# EasyEDA Pro project Dual_Motor_Driver_V3.1.eprj, board PCB2
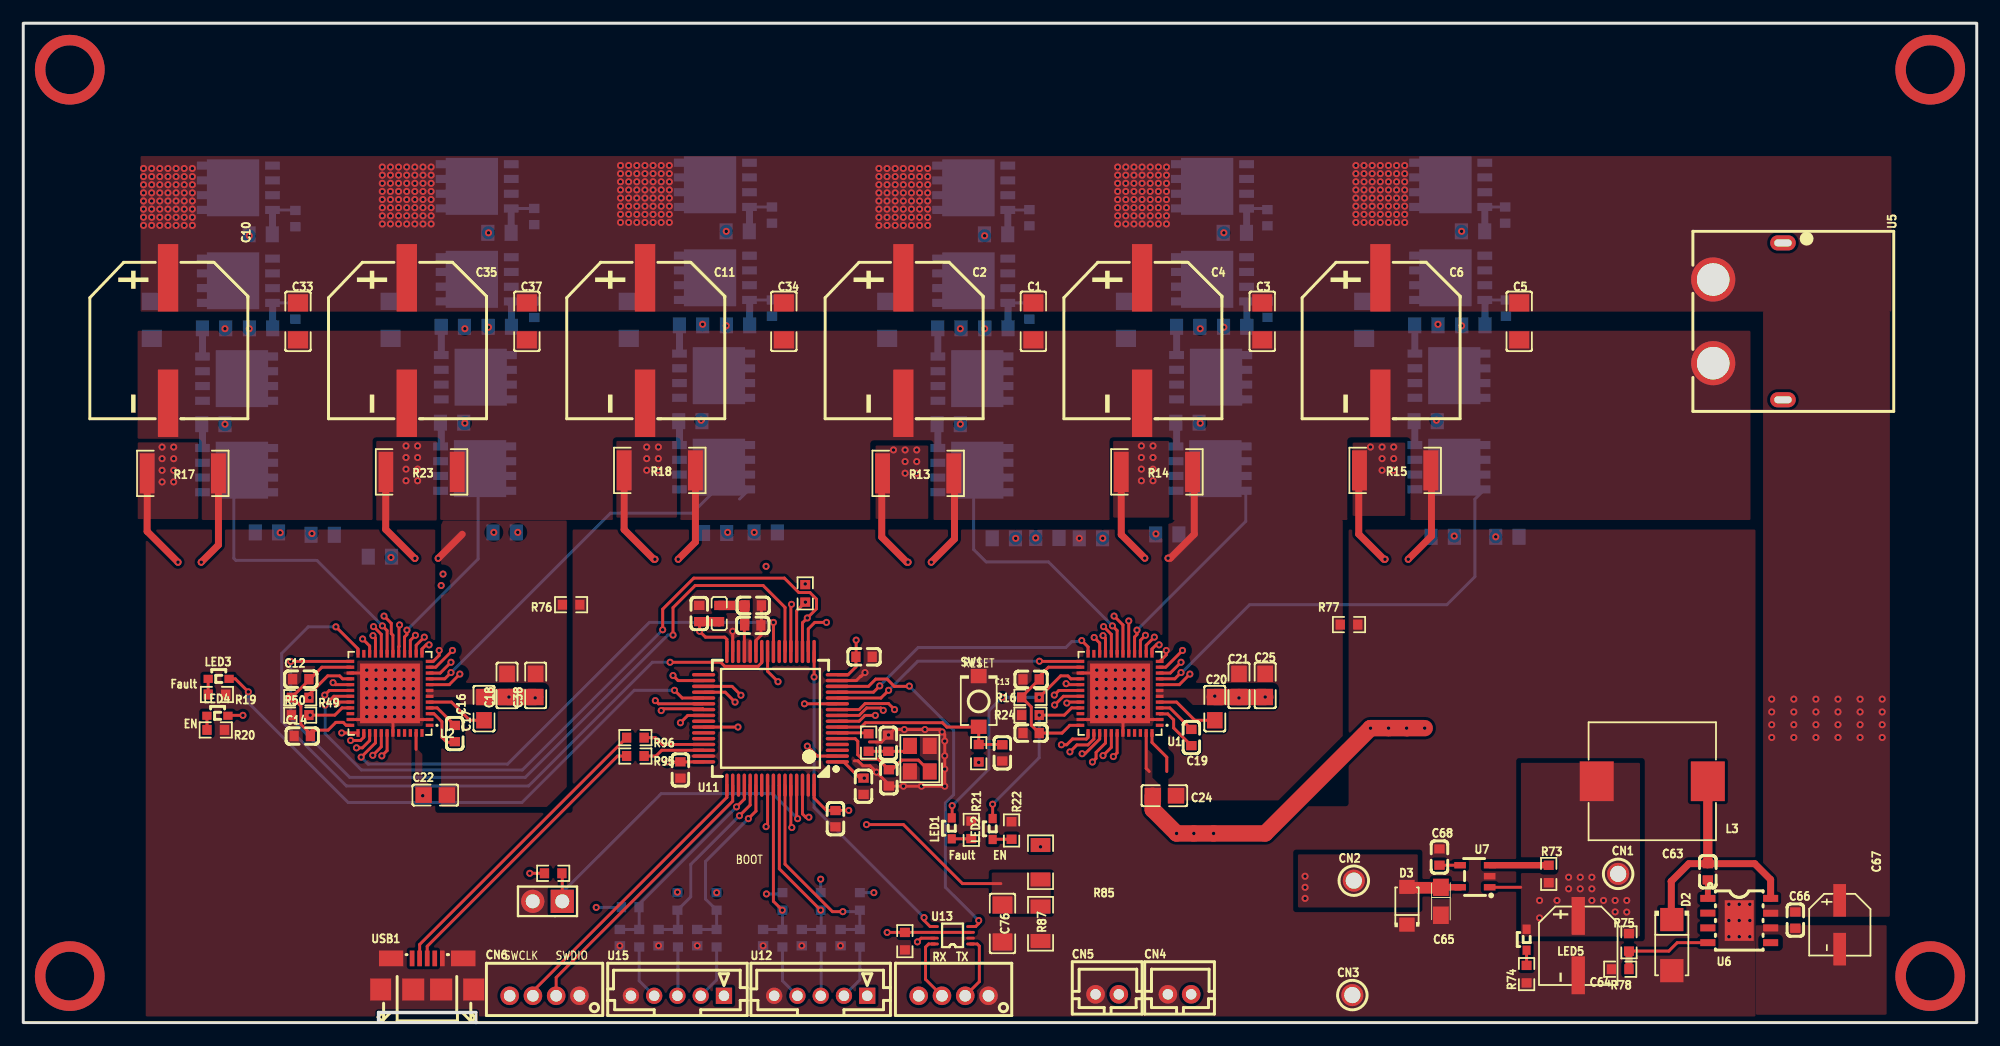
[diagram p2: board, top side]
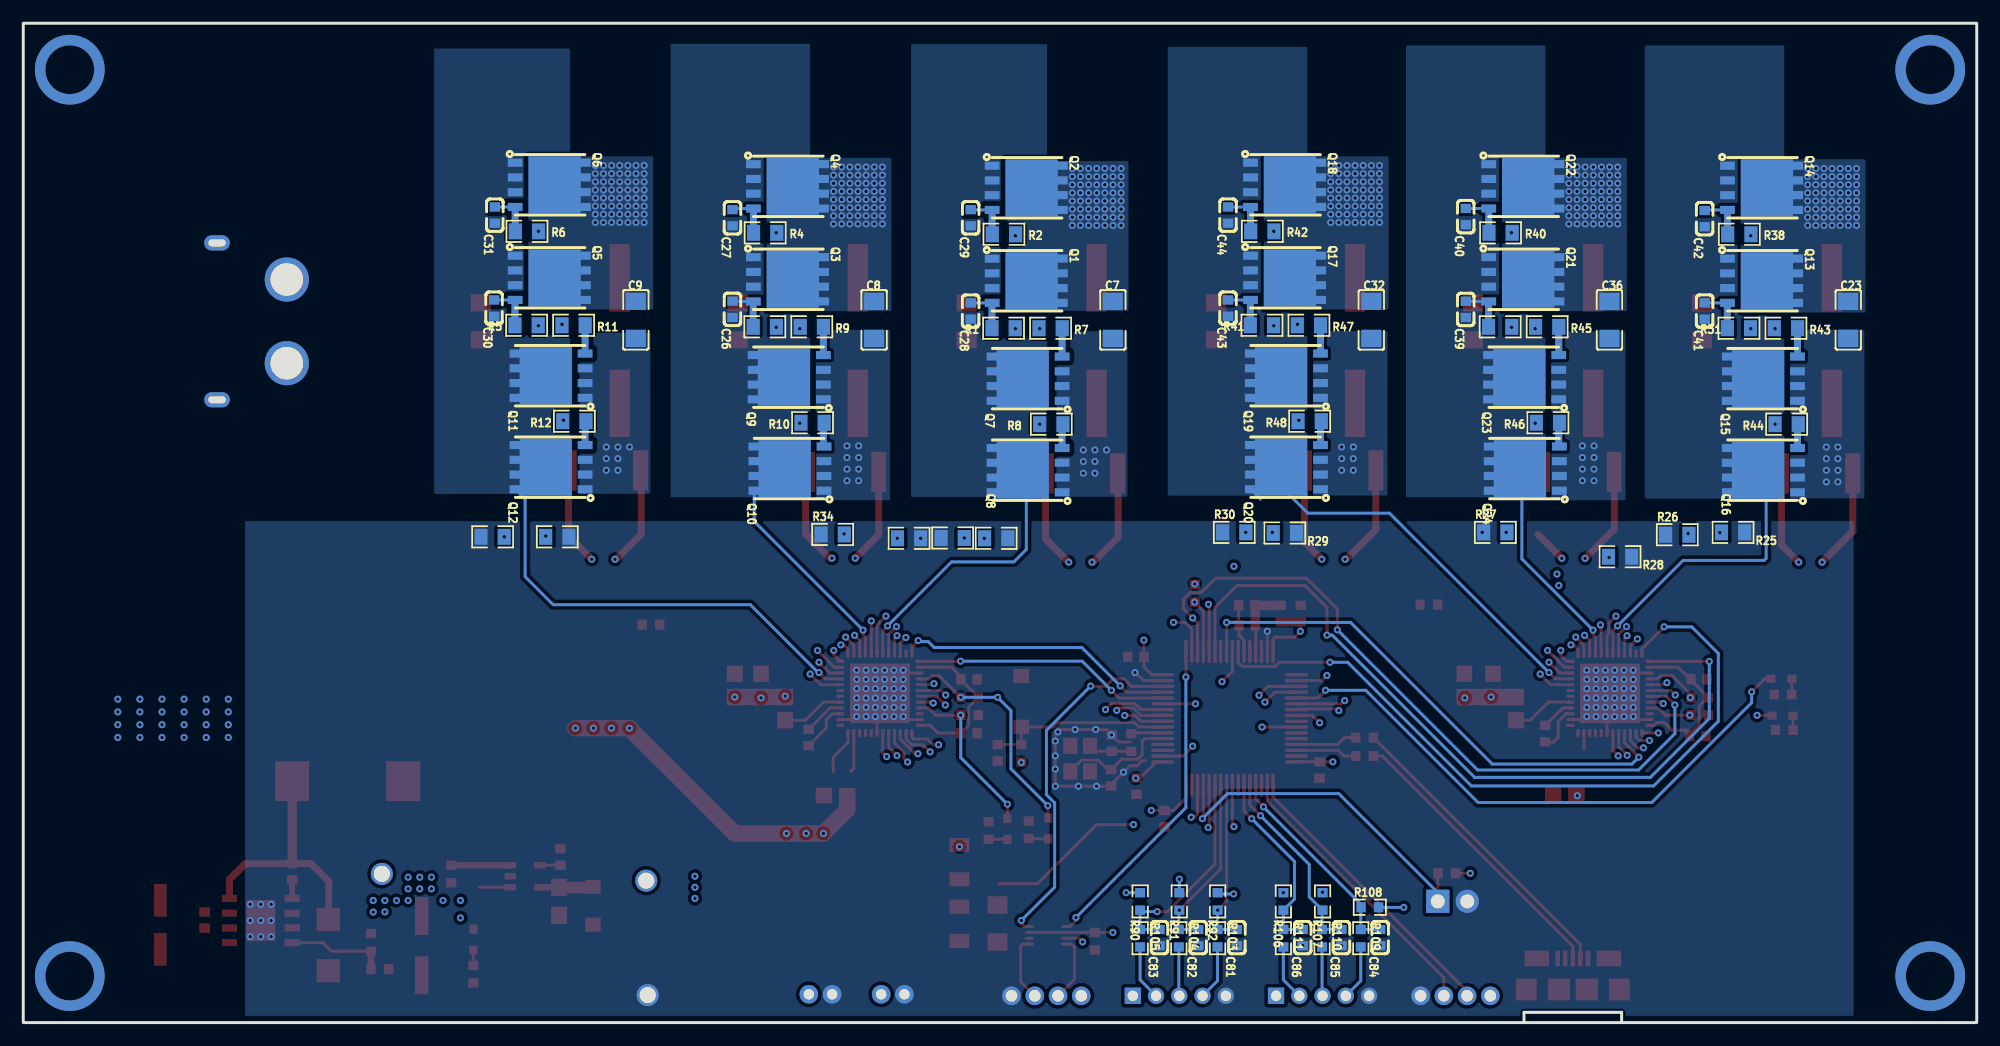
[diagram p3: board, bottom side, seen from below]

Outline 168 x 86.01 mm; copper layers: Top Layer, Inner1, Inner2, Bottom Layer. Coordinates in mm from the lower left corner of the outline.
Outline path: rectangle 0,86.01 168,0.01
Stack: Top Layer 0.035mm 外层铜厚1oz / Dielectric1 0.2104mm 7628 RC49% 8.6mil / Inner1 0.0152mm 内层铜厚 / Dielectric2 1.065mm 1.1mm H/HOZ Copper / Inner2 0.0152mm 内层铜厚 / Dielectric3 0.2104mm 7628 RC49% 8.6mil / Bottom Layer 0.035mm 外层铜厚1oz

## Design rules (mm)
template: 自定义配置
spacing copperThickness1oz (default): track to track 0.102, other pairs 0.152 to 0.3
spacing copperThickness2oz: track to track 0.203, other pairs 0.152 to 0.3
track width copperThickness1oz (default): min 0.127, default 0.254, max 2.54
track width copperThickness2oz: min 0.203, default 0.254, max 2.54
differential pair differentialPair (default): width min 0.127, default 0.254, max 2.54; gap min 0.152, default 0.152
via viaSize (default): diameter min 0.5, default 0.61, max 10; hole min 0.3, default 0.305, max 6.3
pour e216 uses copperRegion

## Placement (name value [footprint] x y rotation side)
C1  100nF  [C1206]  86.87 60.36 90 top
C2  220uF  [CAP-SMD_BD12.5-L13.5-W13.5-FD-1]  75.69 58.71 270 top
C3  100nF  [C1206]  106.55 60.36 90 top
C4  220uF  [CAP-SMD_BD12.5-L13.5-W13.5-FD-1]  96.23 58.71 270 top
C5  100nF  [C1206]  128.65 60.36 90 top
C6  220uF  [CAP-SMD_BD12.5-L13.5-W13.5-FD-1]  116.71 58.71 270 top
C7  10nF  [C1206]  74.29 60.49 90 bottom
C8  10nF  [C1206]  94.83 60.49 90 bottom
C9  10nF  [C1206]  115.32 60.49 90 bottom
C10  220uF  [CAP-SMD_BD12.5-L13.5-W13.5-FD-1]  12.46 58.71 270 top
C11  220uF  [CAP-SMD_BD12.5-L13.5-W13.5-FD-1]  53.47 58.71 270 top
C12  100nF  [C0603]  23.87 29.57 0 top
C13  100nF  [C0603]  86.67 29.55 0 top
C14  100nF  [C0603]  24 24.67 0 top
C15  100nF  [C0603]  86.67 24.93 0 top
C16  47nF  [C0603]  37.11 24.89 270 top
C17  1uF  [C0805]  39.62 27.03 90 top
C18  100nF  [C0805]  41.6 29.03 90 top
C19  47nF  [C0603]  100.46 24.55 270 top
C20  1uF  [C0805]  102.47 27.03 90 top
C21  100nF  [C0805]  104.55 29.03 90 top
C22  100nF  [C0805]  35.43 19.59 0 top
C23  10nF  [C1206]  11.05 60.49 90 bottom
C24  100nF  [C0805]  98.14 19.54 0 top
C25  10uF  [C0805]  106.81 29.03 90 top
C26  100pF  [C0603]  107 61.4 90 bottom
C27  100pF  [C0603]  107 69.28 90 bottom
C28  100pF  [C0603]  86.52 61.25 90 bottom
C29  100pF  [C0603]  86.52 69.28 90 bottom
C30  100pF  [C0603]  127.51 61.5 90 bottom
C31  100pF  [C0603]  127.44 69.5 90 bottom
C32  10nF  [C1206]  52.07 60.49 90 bottom
C33  100nF  [C1206]  23.63 60.36 90 top
C34  100nF  [C1206]  65.41 60.36 90 top
C35  220uF  [CAP-SMD_BD12.5-L13.5-W13.5-FD-1]  32.98 58.71 270 top
C36  10nF  [C1206]  31.59 60.49 90 bottom
C37  100nF  [C1206]  43.31 60.36 90 top
C38  10uF  [C0805]  44.07 29.03 90 top
C39  100pF  [C0603]  43.94 61.39 90 bottom
C40  100pF  [C0603]  43.94 69.38 90 bottom
C41  100pF  [C0603]  23.4 61.25 90 bottom
C42  100pF  [C0603]  23.4 69.2 90 bottom
C43  100pF  [C0603]  64.39 61.5 90 bottom
C44  100pF  [C0603]  64.39 69.5 90 bottom
C63  10nF  [C0603]  144.87 12.99 270 top
C64  100uF  [CAP-SMD_BD6.3-L6.6-W6.6-LS7.2-R-RD]  133.73 6.64 90 top
C65  2.2uF  [CASE-A_3216]  121.92 10.45 270 top
C66  100nF  [C0603]  152.4 8.83 90 top
C67  10uF  [CAP-SMD_BD5.0-L5.3-W5.3-LS6.0-FD]  156.21 8.43 270 top
C68  470pF  [C0603]  121.79 14.26 270 top
C69  100nF  [C0603]  72.26 20.36 90 top
C70  100nF  [C0603]  69.85 17.56 90 top
C71  100nF  [C0603]  72.31 31.49 180 top
C72  100nF  [C0603]  56.52 21.75 90 top
C73  100nF  [C0603]  58.14 35.22 270 top
C74  10uF  [C0603]  62.78 35.91 180 top
C75  100nF  [C0603]  62.74 34.2 180 top
C76  100nF  [C1206]  84.21 8.54 90 top
C77  20pF  [C0603]  74.44 21.08 270 top
C78  20pF  [C0603]  74.4 24.06 90 top
C80  100nF  [C0603]  84.2 23.22 90 top
C81  10nF  [C0603]  63.63 7.33 90 bottom
C82  10nF  [C0603]  66.96 7.33 90 bottom
C83  10nF  [C0603]  70.28 7.33 90 bottom
C84  10nF  [C0603]  51.31 7.33 90 bottom
C85  10nF  [C0603]  54.64 7.33 90 bottom
C86  10nF  [C0603]  57.97 7.33 90 bottom
CN1  RH-5001  [TEST-TH_BD2.54-P1.4_BLACK]  137.16 12.81 0 top
CN2  RH-5001  [TEST-TH_BD2.54-P1.4_BLACK]  114.43 12.23 0 top
CN3  RH-5001  [TEST-TH_BD2.54-P1.4_BLACK]  114.3 2.38 0 top
CN4  B2B-PH-K-S(LF)(SN)  [CONN-TH_B2B-PH-K-S]  99.44 2.45 0 top
CN5  B2B-PH-K-S(LF)(SN)  [CONN-TH_B2B-PH-K-S]  93.22 2.45 0 top
CN6  B4B-PH-K-S(LF)(SN)  [CONN-TH_B4B-PH-K-S]  44.83 2.32 0 top
CN7  B4B-PH-K-S(LF)(SN)  [CONN-TH_B4B-PH-K-S]  80.01 2.32 0 top
D2  SS56  [SMA_L4.3-W2.6-LS5.2-RD]  141.77 6.68 270 top
D3  SMF3.3  [SOD-123FL_L3.0-W1.9-LS3.7-FD]  119 10.07 270 top
H1  PZ254V-11-02P  [HDR-TH_2P-P2.54-V-M]  45.08 10.45 180 top
L3  15uH  [IND-SMD_L10.8-W10.0_SLO1040H]  140.1 20.78 180 top
L4  BLM18KG121TN1D  [L0603]  59.85 35.21 90 top
LED1  LTST-S270KGKT  [LED-SMD_L1.7-W0.6-RD]  79.85 16.73 90 top
LED2  LTST-S270KGKT  [LED-SMD_L1.7-W0.6-RD]  83.37 16.67 90 top
LED3  LTST-S270KGKT  [LED-SMD_L1.7-W0.6-RD]  16.8 29.6 0 top
LED4  LTST-S270KGKT  [LED-SMD_L1.7-W0.6-RD]  16.7 26.42 0 top
LED5  LTST-S270KGKT  [LED-SMD_L1.7-W0.6-RD]  129.29 7.15 90 top
Q1  CSD18540Q5B  [VSON-CLIP-8_L5.0-W6.0-P1.27-BL]  81.67 63.85 270 bottom
Q2  CSD18540Q5B  [VSON-CLIP-8_L5.0-W6.0-P1.27-BL]  81.67 71.85 270 bottom
Q3  CSD18540Q5B  [VSON-CLIP-8_L5.0-W6.0-P1.27-BL]  102.21 63.98 270 bottom
Q4  CSD18540Q5B  [VSON-CLIP-8_L5.0-W6.0-P1.27-BL]  102.21 71.98 270 bottom
Q5  CSD18540Q5B  [VSON-CLIP-8_L5.0-W6.0-P1.27-BL]  122.7 64.11 270 bottom
Q6  CSD18540Q5B  [VSON-CLIP-8_L5.0-W6.0-P1.27-BL]  122.7 72.11 270 bottom
Q7  CSD18540Q5B  [VSON-CLIP-8_L5.0-W6.0-P1.27-BL]  81.66 55.43 90 bottom
Q8  CSD18540Q5B  [VSON-CLIP-8_L5.0-W6.0-P1.27-BL]  81.66 47.56 90 bottom
Q9  CSD18540Q5B  [VSON-CLIP-8_L5.0-W6.0-P1.27-BL]  102.19 55.55 90 bottom
Q10  CSD18540Q5B  [VSON-CLIP-8_L5.0-W6.0-P1.27-BL]  102.13 47.69 90 bottom
Q11  CSD18540Q5B  [VSON-CLIP-8_L5.0-W6.0-P1.27-BL]  122.68 55.68 90 bottom
Q12  CSD18540Q5B  [VSON-CLIP-8_L5.0-W6.0-P1.27-BL]  122.68 47.81 90 bottom
Q13  CSD18540Q5B  [VSON-CLIP-8_L5.0-W6.0-P1.27-BL]  18.43 63.85 270 bottom
Q14  CSD18540Q5B  [VSON-CLIP-8_L5.0-W6.0-P1.27-BL]  18.43 71.85 270 bottom
Q15  CSD18540Q5B  [VSON-CLIP-8_L5.0-W6.0-P1.27-BL]  18.42 55.43 90 bottom
Q16  CSD18540Q5B  [VSON-CLIP-8_L5.0-W6.0-P1.27-BL]  18.42 47.56 90 bottom
Q17  CSD18540Q5B  [VSON-CLIP-8_L5.0-W6.0-P1.27-BL]  59.45 64.11 270 bottom
Q18  CSD18540Q5B  [VSON-CLIP-8_L5.0-W6.0-P1.27-BL]  59.45 72.11 270 bottom
Q19  CSD18540Q5B  [VSON-CLIP-8_L5.0-W6.0-P1.27-BL]  59.44 55.68 90 bottom
Q20  CSD18540Q5B  [VSON-CLIP-8_L5.0-W6.0-P1.27-BL]  59.44 47.81 90 bottom
Q21  CSD18540Q5B  [VSON-CLIP-8_L5.0-W6.0-P1.27-BL]  38.97 63.98 270 bottom
Q22  CSD18540Q5B  [VSON-CLIP-8_L5.0-W6.0-P1.27-BL]  38.97 71.98 270 bottom
Q23  CSD18540Q5B  [VSON-CLIP-8_L5.0-W6.0-P1.27-BL]  38.95 55.55 90 bottom
Q24  CSD18540Q5B  [VSON-CLIP-8_L5.0-W6.0-P1.27-BL]  38.89 47.69 90 bottom
R1  0805W8F220JT5E  [R0805]  83.69 59.77 180 bottom
R2  0805W8F220JT5E  [R0805]  83.66 67.85 0 bottom
R3  0805W8F220JT5E  [R0805]  104.23 59.89 180 bottom
R4  0805W8F220JT5E  [R0805]  104.19 67.98 0 bottom
R5  0805W8F220JT5E  [R0805]  124.71 60.02 180 bottom
R6  0805W8F220JT5E  [R0805]  124.68 68.11 0 bottom
R7  0805W8F220JT5E  [R0805]  79.65 59.77 0 bottom
R8  0805W8F220JT5E  [R0805]  79.59 51.51 180 bottom
R9  0805W8F220JT5E  [R0805]  100.18 59.89 0 bottom
R10  0805W8F220JT5E  [R0805]  100.12 51.64 180 bottom
R11  0805W8F220JT5E  [R0805]  120.67 60.02 0 bottom
R12  0805W8F220JT5E  [R0805]  120.61 51.77 180 bottom
R13  5mΩ  [R2512]  76.96 47.28 180 top
R14  5mΩ  [R2512]  97.5 47.4 180 top
R15  5mΩ  [R2512]  117.98 47.53 180 top
R16  0603WAF1001T5E  [R0603]  86.62 28 180 top
R17  5mΩ  [R2512]  13.72 47.28 180 top
R18  5mΩ  [R2512]  54.74 47.53 180 top
R19  330Ω  [R0603]  16.66 28.25 180 top
R20  330Ω  [R0603]  16.55 25.2 180 top
R21  330Ω  [R0603]  81.53 16.6 270 top
R22  330Ω  [R0603]  84.99 16.55 270 top
R23  5mΩ  [R2512]  34.25 47.4 180 top
R24  0603WAF1001T5E  [R0603]  86.62 26.47 0 top
R25  10kΩ  [R0805]  20.95 42.2 0 bottom
R26  10kΩ  [R0805]  25.75 42 180 bottom
R27  10kΩ  [R0805]  41.4 42.2 180 bottom
R28  10kΩ  [R0805]  30.67 40.1 0 bottom
R29  10kΩ  [R0805]  59.5 42.15 0 bottom
R30  10kΩ  [R0805]  63.85 42.2 180 bottom
R31  0805W8F220JT5E  [R0805]  20.45 59.77 180 bottom
R32  10kΩ  [R0805]  84.33 41.69 0 bottom
R33  10kΩ  [R0805]  88.07 41.72 180 bottom
R34  10kΩ  [R0805]  98.39 42.03 180 bottom
R35  10kΩ  [R0805]  91.82 41.69 0 bottom
R36  10kΩ  [R0805]  122.07 41.82 0 bottom
R37  10kΩ  [R0805]  127.63 41.82 180 bottom
R38  0805W8F220JT5E  [R0805]  20.42 67.85 0 bottom
R39  0805W8F220JT5E  [R0805]  40.98 59.89 180 bottom
R40  0805W8F220JT5E  [R0805]  40.95 67.98 0 bottom
R41  0805W8F220JT5E  [R0805]  61.47 60.02 180 bottom
R42  0805W8F220JT5E  [R0805]  61.44 68.11 0 bottom
R43  0805W8F220JT5E  [R0805]  16.41 59.77 0 bottom
R44  0805W8F220JT5E  [R0805]  16.35 51.51 180 bottom
R45  0805W8F220JT5E  [R0805]  36.94 59.89 0 bottom
R46  0805W8F220JT5E  [R0805]  36.88 51.64 180 bottom
R47  0805W8F220JT5E  [R0805]  57.43 60.02 0 bottom
R48  0805W8F220JT5E  [R0805]  57.37 51.77 180 bottom
R49  0603WAF1001T5E  [R0603]  23.81 27.98 180 top
R50  0603WAF1001T5E  [R0603]  23.81 26.47 0 top
R73  10kΩ  [R0603]  131.19 12.81 270 top
R74  330Ω  [R0603]  129.29 4.18 90 top
R75  10kΩ  [R0603]  138.09 6.92 90 top
R76  0Ω  [R0603]  47.12 35.98 180 top
R77  0Ω  [R0603]  114.02 34.26 180 top
R78  3.24kΩ  [R0603]  137.34 4.61 0 top
R85  120kΩ  [R1206]  87.48 13.82 90 top
R87  10kΩ  [R1206]  87.48 8.52 90 top
R90  1kΩ  [R0603]  71.95 10.44 90 bottom
R91  1kΩ  [R0603]  68.58 10.44 90 bottom
R92  1kΩ  [R0603]  65.28 10.44 90 bottom
R93  1kΩ  [R0603]  72.7 24.11 90 top
R94  10kΩ  [R0603]  67.25 36.95 90 top
R95  22Ω  [R0603]  52.64 22.95 180 top
R96  22Ω  [R0603]  52.64 24.54 180 top
R97  10kΩ  [R0603]  75.82 7.02 90 top
R98  10kΩ  [R0603]  82.17 23.19 270 top
R99  10kΩ  [R0603]  45.58 12.86 180 top
R103  22Ω  [R0603]  65.29 7.27 270 bottom
R104  22Ω  [R0603]  68.62 7.27 270 bottom
R105  22Ω  [R0603]  71.95 7.27 270 bottom
R106  1kΩ  [R0603]  59.63 10.44 90 bottom
R107  1kΩ  [R0603]  56.26 10.44 90 bottom
R108  1kΩ  [R0603]  52.2 9.94 180 bottom
R109  22Ω  [R0603]  52.97 7.27 270 bottom
R110  22Ω  [R0603]  56.3 7.27 270 bottom
R111  22Ω  [R0603]  59.63 7.27 270 bottom
SW1  TS-1088-AR02016  [SW-SMD_L3.9-W3.0-P4.45]  82.17 27.65 90 top
U1  DRV8323RSRGZR  [VQFN-48_L7.0-W7.0-P0.50-TL-EP5.1]  94.32 28.35 180 top
U2  DRV8323RSRGZR  [VQFN-48_L7.0-W7.0-P0.50-TL-EP5.1]  31.54 28.35 180 top
U5  XT60PW-F  [TH_2P-XT60PW-F]  148.34 60.36 270 top
U6  TPS5430DDAR  [ESOP-8_L4.9-W3.9-P1.27-LS6.0-TL-EP]  147.57 8.8 0 top
U7  MIC5219-3.3YM5-TR  [SOT-23-5_L3.0-W1.7-P0.95-LS2.8-TL]  124.84 12.61 180 top
U11  STM32G474RET6  [LQFP-64_L10.0-W10.0-P0.50-LS12.0-BL]  64.26 26.2 90 top
U12  B5B-PH-K-S(LF)(SN)  [CONN-TH_B5B-PH-K-S-LF-SN]  68.58 2.32 0 top
U13  TXB0102DCUR  [VSSOP-8_L2.4-W2.1-P0.50-LS3.2-BR]  79.92 7.53 0 top
U15  B5B-PH-K-S(LF)(SN)  [CONN-TH_B5B-PH-K-S-LF-SN]  56.26 2.32 0 top
USB1  ZX62-AB-5PA(31)  [MICRO-USB-SMD_ZX62-AB-5PA]  34.74 4.2 0 top
X1  8MHz  [CRYSTAL-SMD_4P-L3.2-W2.5-BL]  77.11 22.73 90 top

## Footprints (pads in the part's own frame, mm; a bottom-side part is the same pattern mirrored in y, then rotated)
C0603
  rect 0.8x0.9 smd: 1(-0.7,0) 2(0.7,0)
C0805
  rect 1.41x1.35 smd: 1(-1,0) 2(1,0)
C1206
  rect 1.485x1.728 smd: 1(-1.593,0) 2(1.593,0)
CAP-SMD_BD5.0-L5.3-W5.3-LS6.0-FD
  rect 2.8x1.1 smd: 1(-2.1,0) 2(2.1,0)
CAP-SMD_BD6.3-L6.6-W6.6-LS7.2-R-RD
  rect 3.26x1.15 smd: 1(2.555,0) 2(-2.555,0)
CAP-SMD_BD12.5-L13.5-W13.5-FD-1
  rect 5.8x1.75 smd: 1(-5.4,0) 2(5.4,0)
CASE-A_3216
  rect 1.5x1.359 smd: 1(-1.2,0) 2(1.2,0)
CONN-TH_B2B-PH-K-S
  round 1.6 hole 0.9: 1(1,0) 2(-1,0)
CONN-TH_B4B-PH-K-S
  round 1.6 hole 1: 1(3,0) 2(1,0) 3(-1,0) 4(-3,0)
CONN-TH_B5B-PH-K-S-LF-SN
  rect 1.4x1.4 hole 0.9: 1(4,0)
  round 1.4 hole 0.9: 2(2,0) 3(0,0) 4(-2,0) 5(-4,0)
CRYSTAL-SMD_4P-L3.2-W2.5-BL
  rect 1.4x1.2 smd: 1(-1.1,-0.85) 2(1.1,-0.85) 3(1.1,0.85) 4(-1.1,0.85)
ESOP-8_L4.9-W3.9-P1.27-LS6.0-TL-EP
  rect 1.3x0.6 smd: 1(-2.7,1.905) 2(-2.7,0.635) 3(-2.7,-0.635) 4(-2.7,-1.905) 5(2.7,-1.905) 6(2.7,-0.635) 7(2.7,0.635) 8(2.7,1.905)
  rect 2.5x3.5 smd: 9(0,0)
HDR-TH_2P-P2.54-V-M
  rect 2x2 hole 1.2: 1(-1.27,0)
  round 2 hole 1.2: 2(1.27,0)
IND-SMD_L10.8-W10.0_SLO1040H
  rect 2.924x3.419 smd: 1(4.777,0) 2(-4.777,0)
L0603
  rect 0.8x0.864 smd: 1(-0.7,0) 2(0.7,0)
LED-SMD_L1.7-W0.6-RD
  rect 0.8x0.7 smd: 1(-0.9,0) 2(0.9,0)
LQFP-64_L10.0-W10.0-P0.50-LS12.0-BL
  oval 0.3x2 smd: 1(-3.75,-5.75) 2(-3.25,-5.75) 3(-2.75,-5.75) 4(-2.25,-5.75) 5(-1.75,-5.75) 6(-1.25,-5.75) 7(-0.75,-5.75) 8(-0.25,-5.75) 9(0.25,-5.75) 10(0.75,-5.75) 11(1.25,-5.75) 12(1.75,-5.75) 13(2.25,-5.75) 14(2.75,-5.75) 15(3.25,-5.75) 16(3.75,-5.75) 33(3.75,5.75) 34(3.25,5.75) 35(2.75,5.75) 36(2.25,5.75) 37(1.75,5.75) 38(1.25,5.75) 39(0.75,5.75) 40(0.25,5.75) 41(-0.25,5.75) 42(-0.75,5.75) 43(-1.25,5.75) 44(-1.75,5.75) 45(-2.25,5.75) 46(-2.75,5.75) 47(-3.25,5.75) 48(-3.75,5.75)
  oval 2x0.3 smd: 17(5.75,-3.75) 18(5.75,-3.25) 19(5.75,-2.75) 20(5.75,-2.25) 21(5.75,-1.75) 22(5.75,-1.25) 23(5.75,-0.75) 24(5.75,-0.25) 25(5.75,0.25) 26(5.75,0.75) 27(5.75,1.25) 28(5.75,1.75) 29(5.75,2.25) 30(5.75,2.75) 31(5.75,3.25) 32(5.75,3.75) 49(-5.75,3.75) 50(-5.75,3.25) 51(-5.75,2.75) 52(-5.75,2.25) 53(-5.75,1.75) 54(-5.75,1.25) 55(-5.75,0.75) 56(-5.75,0.25) 57(-5.75,-0.25) 58(-5.75,-0.75) 59(-5.75,-1.25) 60(-5.75,-1.75) 61(-5.75,-2.25) 62(-5.75,-2.75) 63(-5.75,-3.25) 64(-5.75,-3.75)
MICRO-USB-SMD_ZX62-AB-5PA
  rect 0.4x1.35 smd: 1(-1.3,1.337) 2(-0.65,1.337) 3(0,1.337) 4(0.65,1.337) 5(1.3,1.337)
  rect 1.8x1.9 smd: 6(-4,-1.337) 6(4,-1.337)
  rect 2.1x1.35 smd: 6(-3.1,1.337) 6(3.1,1.337)
  rect 1.9x1.9 smd: 6(-1.2,-1.337) 6(1.2,-1.337)
R0603
  rect 0.806x0.864 smd: 1(-0.753,0) 2(0.753,0)
R0805
  rect 1.133x1.377 smd: 1(-1,0) 2(1,0)
R1206
  rect 1.208x1.701 smd: 1(-1.479,0) 2(1.479,0)
R2512
  rect 1.282x3.456 smd: 1(-3.067,0) 2(3.067,0)
SMA_L4.3-W2.6-LS5.2-RD
  rect 2x2 smd: 1(-2.2,0) 2(2.2,0)
SOD-123FL_L3.0-W1.9-LS3.7-FD
  rect 1.208x1.33 smd: 1(-1.624,0) 2(1.624,0)
SOT-23-5_L3.0-W1.7-P0.95-LS2.8-TL
  rect 1x0.55 smd: 1(-1.272,0.95) 2(-1.272,0) 3(-1.272,-0.95) 4(1.272,-0.95) 5(1.272,0.95)
SW-SMD_L3.9-W3.0-P4.45
  rect 1.23x1.36 smd: 1(-2.185,0) 2(2.185,0)
TEST-TH_BD2.54-P1.4_BLACK
  round 1.9 hole 1.39: 1(0,0)
TH_2P-XT60PW-F
  oval 1.3x2.2 hole 0.6x1.5: 1(-6.75,3) 2(6.75,3)
  round 3.8 hole 2.8: 3(-3.6,-3) 4(3.6,-3)
VQFN-48_L7.0-W7.0-P0.50-TL-EP5.1
  rect 0.665x0.28 smd: 1(-3.408,2.75) 2(-3.408,2.25) 3(-3.408,1.75) 4(-3.408,1.25) 5(-3.408,0.75) 6(-3.408,0.25) 7(-3.408,-0.25) 8(-3.408,-0.75) 9(-3.408,-1.25) 10(-3.408,-1.75) 11(-3.408,-2.25) 12(-3.408,-2.75) 25(3.408,-2.75) 26(3.408,-2.25) 27(3.408,-1.75) 28(3.408,-1.25) 29(3.408,-0.75) 30(3.408,-0.25) 31(3.408,0.25) 32(3.408,0.75) 33(3.408,1.25) 34(3.408,1.75) 35(3.408,2.25) 36(3.408,2.75)
  rect 0.28x0.665 smd: 13(-2.75,-3.408) 14(-2.25,-3.408) 15(-1.75,-3.408) 16(-1.25,-3.408) 17(-0.75,-3.408) 18(-0.25,-3.408) 19(0.25,-3.408) 20(0.75,-3.408) 21(1.25,-3.408) 22(1.75,-3.408) 23(2.25,-3.408) 24(2.75,-3.408) 37(2.75,3.408) 38(2.25,3.408) 39(1.75,3.408) 40(1.25,3.408) 41(0.75,3.408) 42(0.25,3.408) 43(-0.25,3.408) 44(-0.75,3.408) 45(-1.25,3.408) 46(-1.75,3.408) 47(-2.25,3.408) 48(-2.75,3.408)
  rect 5.15x5.15 smd: 49(0,0)
VSON-CLIP-8_L5.0-W6.0-P1.27-BL
  rect 0.7x1.27 smd: 1(-1.904,-3) 2(-0.636,-3) 3(0.636,-3) 4(1.906,-3)
  rect 0.7x1 smd: 5(1.904,3) 6(0.634,3) 7(-0.636,3) 8(-1.906,3)
  rect 4.9x4.5 smd: 8(-0.001,0.39)
VSSOP-8_L2.4-W2.1-P0.50-LS3.2-BR
  oval 0.75x0.25 smd: 1(1.55,-0.75) 2(1.55,-0.25) 3(1.55,0.25) 4(1.55,0.75) 5(-1.55,0.75) 6(-1.55,0.25) 7(-1.55,-0.25) 8(-1.55,-0.75)

## Nets
3.3V: C65.1 C69.2 C70.2 C71.2 C72.2 C73.2 CN2.1 CN5.1 CN6.4 D3.1 L4.1 R90.2 R91.2 R92.2 R94.2 R97.2 R98.2 R99.2 R106.2 R107.2 R108.2 U7.5 U11.1 U11.16 U11.32 U11.48 U11.64 U13.3 U13.6
5V: C64.1 CN1.1 CN4.1 CN7.4 L3.1 LED5.2 R73.2 R75.2 U7.1 U12.1 U13.7 U15.1
AGND: C12.1 C13.1 C14.1 C15.1 C64.2 C65.2 C66.1 C67.2 C68.1 C69.1 C70.1 C71.1 C72.1 C73.1 C74.1 C75.1 C76.1 C77.2 C78.2 C80.1 C81.1 C82.1 C83.1 C84.1 C85.1 C86.1 CN3.1 CN4.2 CN5.2 CN6.1 CN7.1 D2.2 D3.2 H1.2 R19.1 R20.1 R21.1 R22.1 R24.1 R25.1 R26.1 R27.1 R28.1 R29.1 R30.1 R32.1 R33.1 R34.1 R35.1 R36.1 R37.1 R50.1 R74.1 R76.1 R77.1 R78.1 R87.1 R97.1 SW1.2 U1.2 U1.27 U1.35 U1.43 U1.49 U2.2 U2.27 U2.35 U2.43 U2.49 U6.6 U6.9 U7.2 U11.15 U11.27 U11.31 U11.47 U11.63 U12.5 U13.2 U15.5 USB1.5 USB1.6 X1.2 X1.4
PGND: C1.1 C2.2 C3.1 C4.2 C5.1 C6.2 C10.2 C11.2 C18.2 C21.2 C22.2 C24.2 C25.2 C33.1 C34.1 C35.2 C37.1 C38.2 R13.1 R14.1 R15.1 R17.1 R18.1 R23.1 R76.2 R77.2 U1.12 U1.13 U1.22 U2.12 U2.13 U2.22 U5.4
VDDA: C74.2 C75.2 L4.2 U11.28 U11.29
$1I2936\$1N44875: C20.1 U1.5
$1I2936\$1N44882: C19.1 U1.4
$1I2936\$1N44883: C19.2 U1.3
$1I2936\$1N44900: C28.2 Q1.4 R1.1
$1I2936\$1N44903: C29.2 Q2.4 R2.2
$1I2936\$1N44906: Q7.4 R7.1
$1I2936\$1N44907: Q8.4 R8.2
$1I2936\$1N44911: C30.2 Q5.4 R5.1
$1I2936\$1N44914: C31.2 Q6.4 R6.2
$1I2936\$1N44917: Q11.4 R11.1
$1I2936\$1N44918: Q12.4 R12.2
$1I2936\$1N44964: C26.2 Q3.4 R3.1
$1I2936\$1N44967: C27.2 Q4.4 R4.2
$1I2936\$1N44970: Q9.4 R9.1
$1I2936\$1N44971: Q10.4 R10.2
$1I2936\$1N44985: LED1.1 R21.2
$1I2936\$1N44986: LED2.1 R22.2
$1I2936\A_H: C9.1 Q11.1 Q11.2 Q11.3 Q12.1 Q12.2 Q12.3 R15.2 U1.11
$1I2936\B_H: C8.1 Q9.1 Q9.2 Q9.3 Q10.1 Q10.2 Q10.3 R14.2 U1.14
$1I2936\C_H: C7.1 Q7.1 Q7.2 Q7.3 Q8.1 Q8.2 Q8.3 R13.2 U1.21
$1I2936\DVDD: C13.2 C15.2 R16.2 U1.26 U1.36
$1I2936\GH_A: R5.2 R6.1 R37.2 U1.8
$1I2936\GH_B: R3.2 R4.1 R34.2 U1.17
$1I2936\GH_C: R1.2 R2.1 R33.2 U1.18
$1I2936\GL_A: R11.2 R12.1 R36.2 U1.10
$1I2936\GL_B: R9.2 R10.1 R35.2 U1.15
$1I2936\GL_C: R7.2 R8.1 R32.2 U1.20
$1I3034\$1N44875: C17.1 U2.5
$1I3034\$1N44882: C16.1 U2.4
$1I3034\$1N44883: C16.2 U2.3
$1I3034\$1N44900: C41.2 Q13.4 R31.1
$1I3034\$1N44903: C42.2 Q14.4 R38.2
$1I3034\$1N44906: Q15.4 R43.1
$1I3034\$1N44907: Q16.4 R44.2
$1I3034\$1N44911: C43.2 Q17.4 R41.1
$1I3034\$1N44914: C44.2 Q18.4 R42.2
$1I3034\$1N44917: Q19.4 R47.1
$1I3034\$1N44918: Q20.4 R48.2
$1I3034\$1N44964: C39.2 Q21.4 R39.1
$1I3034\$1N44967: C40.2 Q22.4 R40.2
$1I3034\$1N44970: Q23.4 R45.1
$1I3034\$1N44971: Q24.4 R46.2
$1I3034\$1N44985: LED3.1 R19.2
$1I3034\$1N44986: LED4.1 R20.2
$1I3034\A_H: C32.1 Q19.1 Q19.2 Q19.3 Q20.1 Q20.2 Q20.3 R18.2 U2.11
$1I3034\B_H: C36.1 Q23.1 Q23.2 Q23.3 Q24.1 Q24.2 Q24.3 R23.2 U2.14
$1I3034\C_H: C23.1 Q15.1 Q15.2 Q15.3 Q16.1 Q16.2 Q16.3 R17.2 U2.21
$1I3034\DVDD: C12.2 C14.2 R49.2 U2.26 U2.36
$1I3034\GH_A: R30.2 R41.2 R42.1 U2.8
$1I3034\GH_B: R27.2 R39.2 R40.1 U2.17
$1I3034\GH_C: R26.2 R31.2 R38.1 U2.18
$1I3034\GL_A: R29.2 R47.2 R48.1 U2.10
$1I3034\GL_B: R28.2 R45.2 R46.1 U2.15
$1I3034\GL_C: R25.2 R43.2 R44.1 U2.20
B1: CN7.3 U13.8
B2: CN7.2 U13.1
D+: R95.2 USB1.3
D-: R96.2 USB1.2
M1_A: C30.1 C31.1 Q5.1 Q5.2 Q5.3 Q6.1 Q6.2 Q6.3 Q11.5 Q11.6 Q11.7 Q11.8 Q12.5 Q12.6 Q12.7 Q12.8 U1.9
M1_B: C26.1 C27.1 Q3.1 Q3.2 Q3.3 Q4.1 Q4.2 Q4.3 Q9.5 Q9.6 Q9.7 Q9.8 Q10.5 Q10.6 Q10.7 Q10.8 U1.16
M1_C: C28.1 C29.1 Q1.1 Q1.2 Q1.3 Q2.1 Q2.2 Q2.3 Q7.5 Q7.6 Q7.7 Q7.8 Q8.5 Q8.6 Q8.7 Q8.8 U1.19
M2_A: C43.1 C44.1 Q17.1 Q17.2 Q17.3 Q18.1 Q18.2 Q18.3 Q19.5 Q19.6 Q19.7 Q19.8 Q20.5 Q20.6 Q20.7 Q20.8 U2.9
M2_B: C39.1 C40.1 Q21.1 Q21.2 Q21.3 Q22.1 Q22.2 Q22.3 Q23.5 Q23.6 Q23.7 Q23.8 Q24.5 Q24.6 Q24.7 Q24.8 U2.16
M2_C: C41.1 C42.1 Q13.1 Q13.2 Q13.3 Q14.1 Q14.2 Q14.3 Q15.5 Q15.6 Q15.7 Q15.8 Q16.5 Q16.6 Q16.7 Q16.8 U2.19
MISO: R94.1 U1.29 U2.29 U11.20
MOSI: U1.30 U2.30 U11.21
NRST: C80.2 R98.1 SW1.1 U11.7
PA0: U1.25 U11.12
PA1: U1.24 U11.13
PA4: U1.32 U11.18
PA8: C76.2 R85.1 R87.2 U11.42
PA13: CN6.2 U11.50
PA14: CN6.3 U11.49
PB0: U2.40 U11.24
PB1: U2.42 U11.25
PB2: U2.24 U11.26
PB3: U2.38 U11.56
PB4: C81.2 R92.1 R103.1 U11.57
PB5: C82.2 R91.1 R104.1 U11.58
PB6: C83.2 R90.1 R105.1 U11.59
PB7: LED4.2 R50.2 U2.33 U11.60
PB8: H1.1 R99.1 U11.61
PB9: U1.42 U11.62
PB12: U2.32 U11.34
PB13: U1.38 U11.35
PB14: U1.40 U11.36
PB15: LED3.2 R49.1 U2.28 U11.37
PC0: U1.37 U11.8
PC1: U1.39 U11.9
PC2: U1.41 U11.10
PC3: LED1.2 R16.1 U1.28 U11.11
PC4: U2.25 U11.22
PC6: U2.37 U11.38
PC7: U2.39 U11.39
PC8: U2.41 U11.40
PC10: C84.2 R108.1 R109.1 U11.52
PC11: C85.2 R107.1 R110.1 U11.53
PC12: C86.2 R106.1 R111.1 U11.54
PC13: LED2.2 R24.2 U1.33 U11.2
PH: C63.1 D2.1 L3.2 U6.8
SCK: U1.31 U2.31 U11.19
UART_RX: U11.17 U13.5
UART_TX: U11.14 U13.4
VM: C1.2 C2.1 C3.2 C4.1 C5.2 C6.1 C7.2 C8.2 C9.2 C10.1 C11.1 C17.2 C18.1 C20.2 C21.1 C22.1 C23.2 C24.1 C25.1 C32.2 C33.2 C34.2 C35.1 C36.2 C37.2 C38.1 C66.2 C67.1 Q1.5 Q1.6 Q1.7 Q1.8 Q2.5 Q2.6 Q2.7 Q2.8 Q3.5 Q3.6 Q3.7 Q3.8 Q4.5 Q4.6 Q4.7 Q4.8 Q5.5 Q5.6 Q5.7 Q5.8 Q6.5 Q6.6 Q6.7 Q6.8 Q13.5 Q13.6 Q13.7 Q13.8 Q14.5 Q14.6 Q14.7 Q14.8 Q17.5 Q17.6 Q17.7 Q17.8 Q18.5 Q18.6 Q18.7 Q18.8 Q21.5 Q21.6 Q21.7 Q21.8 Q22.5 Q22.6 Q22.7 Q22.8 R85.2 U1.6 U1.7 U1.47 U2.6 U2.7 U2.47 U5.3 U6.7
$1N551: R75.1 R78.2 U6.4
$1N561: C63.2 U6.1
$1N2428: C68.2 U7.4
$1N2597: R73.1 U7.3
$1N72792: C77.1 U11.5 X1.1
$1N72945: R93.2 U11.6
$1N72949: C78.1 R93.1 X1.3
$1N77944: R95.1 U11.46
$1N77945: R96.1 U11.45
$1N87601: LED5.1 R74.2
$1N97516: R103.2 U12.4
$1N97530: R104.2 U12.3
$1N97534: R105.2 U12.2
$1N98528: R109.2 U15.4
$1N98530: R110.2 U15.3
$1N98532: R111.2 U15.2

Pads without a net: U1 1 23 34 44 45 46 48; U2 1 23 34 44 45 46 48; U5 1 2; U6 2 3 5; U11 3 4 23 30 33 41 43 44 51 55; USB1 1 4

## Via types
v1: diameter 6, hole 4.2, Top Layer to Bottom Layer, 4 vias
v2: diameter 0.61, hole 0.305, Top Layer to Bottom Layer, 707 vias

## Routing (per net, layer and track width the routed paths; a pad name or vN(x,y) marks a point on that pad's centre or on a via; arc(x,y) is an arc through that point)
3.3V: length 39.6
  Top Layer w0.254: U11.1 70.55,22.45 71.95,21.05 v2(72.32,21.05) ; U13.3 U13.6 76.2,7.78 76.2,7.77 ; v2(55.37,22.45) C72.2 56.52,22.45 U11.48 ; v2(71.63,32.93) 71.63,31.51 C71.2 71.61,30.63 70.93,29.95 U11.16 ; U11.32 60.51,33 60.33,33.18 58.67,33.18 v2(58.17,33.69) 58.17,34.49 C73.2 ; U11.64 68.01,19.34 69.08,18.27 v2(70.99,18.27) ; R99.2 v2(43.56,12.86) ; R97.2 v2(74.29,7.77)
  Top Layer w0.55: U7.5 121.93,11.66
  Top Layer w0.806: C73.2 59.85,34.52 L4.1
  Top Layer w1: 119,11.62 121.89,11.62 C65.1
  Bottom Layer w0.254: v2(63.91,11.08) 65.17,11.08 R92.2 ; R90.2 v2(73.15,11.2) ; R91.2 v2(68.58,12.35) ; v2(49.28,9.93) 51.43,9.93 R108.2
  vias: v2(56.26,11.24) v2(59.63,11.2) v2(67.25,37.76) v2(82.17,22.4) v2(110.24,12.61) v2(110.24,11.66) v2(110.24,10.7)
5V: length 4.3
  Top Layer w0.254: v2(76.9,6.96) 77.22,7.28 U13.7 ; U7.1 128.78,11.66
  vias: v2(130.4,10.52) v2(130.4,9.02) v2(131.9,10.52) v2(132.9,12.52) v2(132.9,11.52) v2(133.9,12.52) v2(133.9,11.52) v2(134.9,12.52) v2(134.9,11.52) v2(134.9,10.52) v2(135.9,10.52) v2(136.9,10.52) v2(136.9,9.54) v2(137.9,10.52) v2(137.9,9.52)
AGND: length 40.9
  Top Layer w0.254: 71.47,22.54 71.79,22.54 72.21,22.12 72.83,22.12 v2(73.38,21.57) 74.44,20.5 C77.2 74.46,20.36 v2(75.7,20.36) v2(77.25,20.36) v2(79.25,20.36) v2(79.25,21.83) v2(79.25,22.97) v2(79.25,24.24) 79.25,24.8 78.81,25.23 v2(77.54,25.23) v2(75.78,25.23) 74.87,25.23 C78.2 ; 29.29,25.97 29.54,26.22 ; U1.27 92.07,30.1 v2(92.32,30.35) ; v2(92.32,26.35) 92.07,26.1 U1.35 ; v2(31.94,26.35) 31.79,26.2 U2.43 ; U2.27 29.29,30.1 v2(29.54,30.35) ; v2(72.39,30.13) 72.09,29.83 72.02,29.83 71.64,29.45 U11.15 ; U2.35 29.29,26.1 ; U11.27 63.01,32.9 63.44,33.33 C75.1 63.48,34.24 63.48,35.91 ; v2(61.01,33.69) U11.31 ; U1.2 96.57,26.1 v2(96.32,26.35) ; v2(33.54,26.35) 33.79,26.1 U2.2 ; v2(74.41,24.77) 73.81,24.17 72.77,24.17 ; v2(94.72,26.35) 94.57,26.2 U1.43
  vias: v2(29.54,29.55) v2(29.54,28.75) v2(29.54,27.95) v2(29.54,27.15) v2(29.54,26.35) v2(30.34,30.35) v2(30.34,29.55) v2(30.34,28.75) v2(30.34,27.95) v2(30.34,27.15) v2(30.34,26.35) v2(31.14,30.35) v2(31.14,29.55) v2(31.14,28.75) v2(31.14,27.95) v2(31.14,27.15) v2(31.14,26.35) v2(31.94,30.35) v2(31.94,29.55) v2(31.94,28.75) v2(31.94,27.95) v2(31.94,27.15) v2(32.74,30.35) v2(32.74,29.55) v2(32.74,28.75) v2(32.74,27.95) v2(32.74,27.15) v2(32.74,26.35) v2(33.54,30.35) v2(33.54,29.55) v2(33.54,28.75) v2(33.54,27.95) v2(33.54,27.15) v2(42.53,42.2) v2(51.31,6.63) v2(54.64,6.63) v2(57.97,6.63) v2(63.63,6.63) v2(66.96,6.63) v2(70.28,6.63) v2(79.02,25.03) v2(90.82,41.69) v2(92.32,29.55) v2(92.32,28.75) v2(92.32,27.95) v2(92.32,27.15) v2(93.12,30.35) v2(93.12,29.55) v2(93.12,28.75) v2(93.12,27.95) v2(93.12,27.15) v2(93.12,26.35) v2(93.92,30.35) v2(93.92,29.55) v2(93.92,28.75) v2(93.92,27.95) v2(93.92,27.15) v2(93.92,26.35) v2(94.72,30.35) v2(94.72,29.55) v2(94.72,28.75) v2(94.72,27.95) v2(94.72,27.15) v2(95.52,30.35) v2(95.52,29.55) v2(95.52,28.75) v2(95.52,27.95) v2(95.52,27.15) v2(95.52,26.35) v2(96.32,30.35) v2(96.32,29.55) v2(96.32,28.75) v2(96.32,27.95) v2(96.32,27.15) v2(146.69,10.2) v2(146.69,8.8) v2(146.69,7.4) v2(147.57,10.2) v2(147.57,8.8) v2(147.57,7.4) v2(148.48,10.2) v2(148.48,8.8) v2(148.48,7.4)
PGND: length 150.8
  Top Layer w0.254: v2(97.68,32.52) 97.43,32.52 97.07,32.16 U1.13 ; v2(34.9,32.52) 34.65,32.52 34.29,32.16 U2.13 ; v2(98.3,32.04) 98.3,31.66 U1.12 ; U2.12 35.25,31.1 35.77,31.61 v2(35.77,32.04) ; U1.22 92.57,32.68 v2(92.1,33.15) ; v2(29.19,33.03) 29.79,32.42 U2.22
  Top Layer w0.6: 16.79,47.28 16.79,41.12 v2(15.31,39.64) ; v2(56.33,39.89) 57.81,41.37 R18.1 ; R14.1 100.71,47.25 100.71,42.05 98.64,39.98 v2(98.45,39.98) ; v2(119.11,39.89) 121.11,41.89 121.11,47.48 R15.1 ; v2(78.09,39.64) 80.08,41.63 80.08,47.22 R13.1 ; v2(35.68,39.97) 37.75,42.04
  Inner1 w0.254: v2(15.31,39.64) 22.58,39.64 v2(29.19,33.03) ; v2(98.3,32.04) 106.73,40.47 117.35,40.47 117.94,39.89 v2(119.11,39.89) ; v2(35.77,32.04) 44.2,40.47 54.57,40.47 55.15,39.89 v2(56.33,39.89) ; v2(92.1,33.15) 85.62,39.64 v2(78.09,39.64) ; v2(35.68,39.97) 35.18,39.46 35.18,32.8 v2(34.9,32.52) ; v2(97.68,32.52) 98.45,33.29 v2(98.45,39.98)
VDDA: length 6.2
  Top Layer w0.254: U11.29 62.01,34.17 C75.2
  Top Layer w0.806: L4.2 C74.2 62.04,35.87 C75.2
(no net): length 3.8
  Top Layer w0.254: U1.48 97.07,24.12 98.34,22.85 98.34,21.63
  vias: v1(4,82.02) v1(4,4.02) v1(164,82.02) v1(164,4.02)
$1I2936\$1N44875: length 5.4
  Top Layer w0.254: U1.5 99.19,27.6 100.75,26.03 C20.1
$1I2936\$1N44882: length 3.5
  Top Layer w0.254: C19.1 98.61,27.1 U1.4
$1I2936\$1N44883: length 4.3
  Top Layer w0.254: C19.2 98.93,25.37 98.93,26.07 98.43,26.58 97.75,26.58 U1.3
$1I2936\$1N44900: length 4
  Bottom Layer w0.254: 86.46,61.95 Q1.4
  Bottom Layer w0.6: Q1.4 84.69,61.93 R1.1
$1I2936\$1N44903: length 3.9
  Bottom Layer w0.254: Q2.4 86.44,69.95 86.46,69.94
  Bottom Layer w0.6: R2.2 84.67,67.87 Q2.4
$1I2936\$1N44906: length 2.4
  Bottom Layer w0.6: Q7.4 78.66,59.76 R7.1
$1I2936\$1N44907: length 2.1
  Bottom Layer w0.6: Q8.4 78.66,51.44 R8.2
$1I2936\$1N44911: length 4.1
  Bottom Layer w0.254: Q5.4 127.6,62.2
  Bottom Layer w0.6: R5.1 125.71,62.18 Q5.4
$1I2936\$1N44914: length 4
  Bottom Layer w0.254: 127.6,70.2 127.6,70.2 Q6.4
  Bottom Layer w0.6: R6.2 125.7,68.12 Q6.4
$1I2936\$1N44917: length 2.4
  Bottom Layer w0.6: Q11.4 119.68,60.02 R11.1
$1I2936\$1N44918: length 2.1
  Bottom Layer w0.6: Q12.4 119.68,51.7 R12.2
$1I2936\$1N44964: length 4
  Bottom Layer w0.254: Q3.4 107.06,62.07 107.06,62.08
  Bottom Layer w0.6: R3.1 105.23,62.05 Q3.4
$1I2936\$1N44967: length 4
  Bottom Layer w0.254: Q4.4 107.06,70.07
  Bottom Layer w0.6: Q4.4 105.21,67.99 R4.2
$1I2936\$1N44970: length 2.4
  Bottom Layer w0.6: R9.1 99.19,59.89 Q9.4
$1I2936\$1N44971: length 2.1
  Bottom Layer w0.6: R10.2 99.19,51.57 99.19,49.58
$1I2936\$1N44985: length 1.7
  Top Layer w0.254: LED1.1 81.51,15.83 R21.2
$1I2936\$1N44986: length 1.6
  Top Layer w0.254: R22.2 83.39,15.79 LED2.1
$1I2936\A_H: length 31.9
  Top Layer w0.254: U1.11 98.25,30.6 v2(99.69,32.04)
  Top Layer w0.6: v2(117.11,39.89) 117.01,39.89 114.85,42.05 114.85,47.47 R15.2
  Inner1 w0.254: v2(99.69,32.04) 107.54,39.89 v2(117.11,39.89)
  vias: v2(115.86,49.55) v2(116.86,49.55) v2(116.86,48.55) v2(116.86,47.55) v2(117.86,49.55) v2(117.86,48.55) v2(117.86,47.55)
$1I2936\B_H: length 17.1
  Top Layer w0.254: v2(97.27,33.19) 96.57,32.49 U1.14
  Top Layer w0.6: R14.2 94.43,42.01 v2(96.45,39.98)
  Inner1 w0.254: v2(96.45,39.98) 97.27,39.16 v2(97.27,33.19)
  vias: v2(96.16,49.64) v2(96.16,48.64) v2(96.16,47.64) v2(96.16,46.64) v2(97.16,49.64) v2(97.16,48.64) v2(97.16,47.64) v2(97.16,46.64)
$1I2936\C_H: length 30.2
  Top Layer w0.254: v2(92.86,33.31) 93.07,33.1 U1.21
  Top Layer w0.6: R13.2 73.83,47.21 73.83,41.79 75.99,39.64 v2(76.09,39.64)
  Inner1 w0.254: v2(92.86,33.31) 85.88,40.29 76.75,40.29 v2(76.09,39.64)
  vias: v2(74.84,49.29) v2(75.84,49.29) v2(75.84,48.29) v2(75.84,47.29) v2(76.84,49.29) v2(76.84,48.29) v2(76.84,47.29)
$1I2936\DVDD: length 13.8
  Top Layer w0.254: U1.36 90,25.6 89.33,24.93 C15.2 86.69,25.61 86.69,27.18 R16.2 85.87,28.04 C13.2 87.37,29.8 88.16,30.6 U1.26
$1I2936\GH_A: length 62.5
  Top Layer w0.254: v2(100.33,30.01) 99.42,29.1 U1.8
  Inner1 w0.254: v2(123.7,68.11) v2(123.7,59.98) 126.62,57.06 126.62,40.42 123.82,37.63 107.95,37.63 v2(100.33,30.01)
  vias: v2(126.63,41.82)
$1I2936\GH_B: length 39.6
  Top Layer w0.254: U1.17 v2(95.07,34.58)
  Inner1 w0.254: v2(103.25,59.85) v2(103.25,67.98)
  Inner2 w0.254: v2(95.07,34.58) 97.41,36.92 v2(97.41,42.07) 103.25,47.91 v2(103.25,59.85)
$1I2936\GH_C: length 40.9
  Top Layer w0.254: U1.18 94.57,34.23 v2(93.81,35)
  Inner1 w0.254: v2(93.81,35) 82.68,46.13 v2(82.68,59.73) v2(82.68,67.73)
  vias: v2(87.07,41.72)
$1I2936\GL_A: length 50.1
  Top Layer w0.254: U1.10 98.64,30.1 v2(99.57,31.02)
  Inner1 w0.254: v2(121.67,60.11) 121.54,59.98 v2(121.54,51.85) 123.06,50.33 v2(123.06,41.88) 123.06,40.17 121.67,38.77 107.31,38.77 v2(99.57,31.02)
$1I2936\GL_B: length 33.6
  Top Layer w0.254: v2(96.51,33.34) 96.07,32.91 U1.15
  Inner1 w0.254: v2(101.22,59.73) v2(101.22,51.6) 101.22,49.31 93.6,41.69 v2(92.84,41.69) 92.84,40.29 96.51,36.62 v2(96.51,33.34)
$1I2936\GL_C: length 33.4
  Top Layer w0.254: U1.20 93.57,33.42 v2(92.91,34.09)
  Inner1 w0.254: v2(92.91,34.09) 85.35,41.65 v2(85.35,41.69) 80.59,46.45 v2(80.59,51.51) v2(80.59,59.73)
$1I3034\$1N44875: length 5.3
  Top Layer w0.254: C17.1 38.39,26.03 36.83,27.6 U2.5
$1I3034\$1N44882: length 2.8
  Top Layer w0.254: 37.11,25.59 35.6,27.1 U2.4
$1I3034\$1N44883: length 4
  Top Layer w0.254: U2.3 35.31,26.6 36,25.91 36,24.56 36.43,24.14 37.06,24.14 C16.2
$1I3034\$1N44900: length 4
  Bottom Layer w0.254: 23.22,61.95 Q13.4
  Bottom Layer w0.6: Q13.4 21.45,61.93 R31.1
$1I3034\$1N44903: length 3.9
  Bottom Layer w0.254: Q14.4 23.2,69.95 23.22,69.94
  Bottom Layer w0.6: Q14.4 21.43,67.87 R38.2
$1I3034\$1N44906: length 2.4
  Bottom Layer w0.6: Q15.4 15.42,59.76 R43.1
$1I3034\$1N44907: length 2.1
  Bottom Layer w0.6: Q16.4 15.42,51.44 R44.2
$1I3034\$1N44911: length 4.1
  Bottom Layer w0.254: Q17.4 64.36,62.2
  Bottom Layer w0.6: R41.1 62.47,62.18 Q17.4
$1I3034\$1N44914: length 4
  Bottom Layer w0.254: 64.36,70.2 64.36,70.2 Q18.4
  Bottom Layer w0.6: R42.2 62.45,68.12 Q18.4
$1I3034\$1N44917: length 2.4
  Bottom Layer w0.6: R47.1 56.44,60.02 Q19.4
$1I3034\$1N44918: length 2.1
  Bottom Layer w0.6: Q20.4 56.44,51.7 R48.2
$1I3034\$1N44964: length 4
  Bottom Layer w0.254: Q21.4 43.81,62.07 43.82,62.08
  Bottom Layer w0.6: R39.1 41.98,62.05 Q21.4
$1I3034\$1N44967: length 4
  Bottom Layer w0.254: Q22.4 43.82,70.07
  Bottom Layer w0.6: Q22.4 41.97,67.99 R40.2
$1I3034\$1N44970: length 2.4
  Bottom Layer w0.6: Q23.4 35.95,59.89 R45.1
$1I3034\$1N44971: length 2.1
  Bottom Layer w0.6: 35.95,49.58 35.95,51.57 R46.2
$1I3034\$1N44985: length 1.3
  Top Layer w0.254: LED3.1 15.9,29.59 R19.2
$1I3034\$1N44986: length 1.2
  Top Layer w0.254: 15.8,26.42 15.8,26.42 15.8,25.2
$1I3034\A_H: length 32
  Top Layer w0.254: v2(36.91,32.04) 35.47,30.6 U2.11
  Top Layer w0.6: v2(54.33,39.89) 54.23,39.89 51.67,42.44 R18.2
  Inner1 w0.254: v2(36.91,32.04) 44.76,39.89 v2(54.33,39.89)
  vias: v2(53.62,49.55) v2(53.62,48.55) v2(53.62,47.55) v2(54.62,49.55) v2(54.62,48.55) v2(54.62,47.55)
$1I3034\B_H: length 17.4
  Top Layer w0.254: v2(34.49,33.19) 33.79,32.49 U2.14
  Top Layer w0.6: R23.2 31.17,47.38 31.17,42.46 33.66,39.97 v2(33.68,39.97)
  Inner1 w0.254: v2(34.49,33.19) 34.49,39.29 33.81,39.97 v2(33.68,39.97)
  vias: v2(32.92,49.64) v2(32.92,48.64) v2(32.92,47.64) v2(32.92,46.64) v2(33.92,49.64) v2(33.92,48.64) v2(33.92,47.64) v2(33.92,46.64)
$1I3034\C_H: length 30.3
  Top Layer w0.254: v2(30.08,33.31) 30.29,33.1 U2.21
  Top Layer w0.6: R17.2 10.65,42.29 v2(13.31,39.64)
  Inner1 w0.254: v2(13.31,39.64) 13.89,40.22 23.17,40.22 v2(30.08,33.31)
  vias: v2(11.94,49.54) v2(11.94,48.54) v2(11.94,47.54) v2(11.94,46.54) v2(12.94,49.54) v2(12.94,48.54) v2(12.94,47.54) v2(12.94,46.54)
$1I3034\DVDD: length 13.9
  Top Layer w0.254: 28.18,30.6 25.68,30.6 23.13,28.04 23.13,28 23.88,27.25 23.88,25.69 24.63,24.93 24.89,25.18 26.21,25.18 26.88,25.85 27.51,25.85 27.77,25.6 28.18,25.6
$1I3034\GH_A: length 60.5
  Top Layer w0.254: v2(37.55,30.01) 36.64,29.1 U2.8
  Inner1 w0.254: v2(37.55,30.01) 45.55,38.01 59.06,38.01 62.86,41.82 v2(62.86,42.2) 62.86,57.57 v2(60.46,59.98) v2(60.46,68.11)
$1I3034\GH_B: length 39.9
  Top Layer w0.254: U2.17 32.29,32.36 32.31,32.38 32.31,34.19 v2(32.36,34.24)
  Inner1 w0.254: v2(35.94,37.63) 40.47,42.15 v2(40.47,42.2) 40.47,59.39 v2(40.01,59.85) v2(40.01,67.98)
  Inner2 w0.254: v2(35.94,37.63) 35.75,37.63 v2(32.36,34.24)
$1I3034\GH_C: length 41.9
  Top Layer w0.254: v2(31.03,35) 31.65,34.37 31.65,33.49 31.79,33.35 U2.18
  Inner1 w0.254: v2(31.03,35) 31.03,35.9 v2(24.83,42.1) 23.47,42.1 19.44,46.13 v2(19.44,59.73) v2(19.44,67.73)
$1I3034\GL_A: length 49.5
  Top Layer w0.254: v2(36.78,31.02) 35.86,30.1 U2.10
  Inner1 w0.254: v2(58.42,60.11) 58.3,59.98 v2(58.3,51.85) 60.58,49.57 v2(60.58,42.2) 57.02,38.64 44.4,38.64 v2(36.78,31.02)
$1I3034\GL_B: length 31.7
  Top Layer w0.254: U2.15 33.29,32.91 v2(33.73,33.34)
  Inner1 w0.254: v2(37.98,59.73) v2(37.98,51.6) 37.98,46.4 v2(31.62,40.04) 33.73,37.94 v2(33.73,33.34)
$1I3034\GL_C: length 33.8
  Top Layer w0.254: v2(30.12,34.09) 30.79,33.42 U2.20
  Inner1 w0.254: v2(17.35,59.73) v2(17.35,51.51) 17.35,46.45 21.62,42.17 v2(22.1,42.17) 22.1,42.12 v2(30.12,34.09)
B1: length 5.7
  Top Layer w0.254: U13.8 77.86,6.78 77.6,6.51 77.6,3.73 CN7.3
B2: length 5.6
  Top Layer w0.254: U13.1 82.04,6.78 82.22,6.6 82.22,3.53 CN7.2
D+: length 25
  Top Layer w0.254: USB1.3 34.74,6.58 51.11,22.95 R95.2
D-: length 26.4
  Top Layer w0.254: R96.2 34.09,6.74 USB1.2
M1_A: length 38.6
  Top Layer w0.254: U1.9 99.03,29.6 v2(99.57,30.13)
  Bottom Layer w0.254: v2(99.57,30.13) 99.63,30.13 105.47,35.98 122.43,35.98 124.84,38.39 124.84,45.07 Q12.8
M1_B: length 18
  Top Layer w0.254: U1.16 95.57,33.2 95.78,33.41 v2(95.78,33.79)
  Bottom Layer w0.254: v2(95.78,33.79) 105.13,43.14 Q10.8
M1_C: length 24.2
  Top Layer w0.254: v2(93.67,34.15) 94.07,33.75 U1.19
  Bottom Layer w0.254: Q8.8 81.74,47.24 81.74,40.73 82.8,39.66 88.16,39.66 v2(93.67,34.15)
M2_A: length 33.6
  Top Layer w0.254: U2.9 36.25,29.6 v2(36.78,30.13)
  Bottom Layer w0.254: 60.28,46.6 57.53,43.85 50.5,43.85 v2(36.78,30.13) ; 61.6,45.07 Q20.8
M2_B: length 17.9
  Top Layer w0.254: v2(33,33.79) 33,33.41 32.79,33.2 U2.16
  Bottom Layer w0.254: v2(33,33.79) 39.12,39.91 39.12,47.04
M2_C: length 24.2
  Top Layer w0.254: v2(30.89,34.15) 31.29,33.75 U2.19
  Bottom Layer w0.254: 18.11,46.4 18.11,39.97 18.29,39.79 25.25,39.79 v2(30.89,34.15)
MISO: length 79.5
  Top Layer w0.254: v2(67.26,36.2) 66.51,35.45 U11.20 ; v2(89.68,29.18) 89.77,29.1 U1.29 ; 28.18,29.1 26.81,29.1 v2(26.64,29.27)
  Inner2 w0.254: v2(89.68,29.18) 87.06,29.18 80.06,36.18 67.28,36.18 v2(67.26,36.2) 67,36.46 67,36.47 66.66,36.81 66.65,36.81 64.85,38.61 v2(36.1,38.61) 33.82,38.61 26.64,31.44 v2(26.64,29.27)
MOSI: length 84.3
  Top Layer w0.254: v2(66.07,36.01) 66.01,35.95 U11.21 ; 28.18,28.6 26.33,28.6 v2(25.93,28.2) ; v2(88.67,28.2) 89.06,28.6 U1.30
  Inner1 w0.254: v2(88.67,28.2) 80,36.87 66.93,36.87 v2(66.07,36.01) 66.07,37.09 v2(63.88,39.28)
  Inner2 w0.254: v2(25.93,28.2) 25.93,31.81 33.4,39.28 v2(63.88,39.28)
NRST: length 16
  Top Layer w0.254: C80.2 84.18,23.95 R98.1 SW1.1 82.15,25.45 79.43,25.45 79.06,25.82 72.43,25.82 72.06,25.45 U11.7
PA0: length 22.2
  Top Layer w0.254: U11.12 73.76,27.95 v2(74.42,28.61) ; U1.25 87.41,31.1 v2(87.39,31.11)
  Bottom Layer w0.254: v2(74.42,28.61) 76.92,31.11 v2(87.39,31.11)
PA1: length 24.2
  Top Layer w0.254: v2(73.66,28.99) 73.12,28.45 U11.13 ; U1.24 91.57,32.35 v2(91.03,32.89)
  Bottom Layer w0.254: v2(73.66,28.99) 76.96,32.29 89.66,32.29 90.17,32.8 90.94,32.8 v2(91.03,32.89)
PA4: length 30.1
  Top Layer w0.254: v2(69.08,34.45) 68.07,34.45 67.51,33.89 U11.18 ; v2(89.75,27.51) 89.83,27.6 U1.32
  Inner1 w0.254: v2(89.75,27.51) 89.69,27.51 87.74,25.56 85.34,25.56 76.45,34.45 v2(69.08,34.45)
PA8: length 31.1
  Top Layer w0.254: v2(72.52,17.05) 75.69,17.05 80.77,11.97 84.07,11.97 ; U11.42 v2(61.47,25.45)
  Inner1 w0.254: v2(72.52,17.05) 70.99,17.05 62.6,25.45 v2(61.47,25.45)
PA13: length 24.4
  Top Layer w0.254: U11.50 61.01,19.07 45.83,3.89 CN6.2
PA14: length 25
  Top Layer w0.254: CN6.3 43.83,2.72 60.51,19.4 U11.49
PB0: length 45.9
  Top Layer w0.254: v2(64.52,34.45) 64.52,31.95 U11.24 ; v2(29.06,22.86) 30.29,24.09 U2.40
  Bottom Layer w0.254: v2(64.52,34.45) 53.85,34.45 41.66,22.26 29.66,22.26 v2(29.06,22.86)
PB1: length 41.8
  Top Layer w0.254: U11.25 64.01,30.24 v2(64.91,29.35) ; U2.42 31.29,23.42 v2(30.84,22.97)
  Inner2 w0.254: v2(30.84,22.97) 52.4,22.97 58.78,29.35 v2(64.91,29.35)
PB2: length 63.8
  Top Layer w0.254: v2(55.63,31.02) 59.98,31.02 60.33,30.67 63.19,30.67 63.51,30.99 U11.26 ; v2(26.89,34.07) 28.79,32.17 U2.24
  Bottom Layer w0.254: v2(26.89,34.07) 24.51,34.07 22.22,31.79 22.22,25.94 27.79,20.38 43.46,20.38 54.1,31.02 v2(55.63,31.02)
PB3: length 45.1
  Top Layer w0.254: U11.56 64.01,17.01 v2(63.88,16.88) ; U2.38 29.29,24.57 29.01,24.29 v2(28.15,24.29)
  Inner2 w0.254: v2(28.15,24.29) 27.85,24 27.85,23.24 29.21,21.88 53.21,21.88 58.17,16.93 63.83,16.93 v2(63.88,16.88)
PB4: length 14.4
  Top Layer w0.254: U11.57 64.51,10.45 v2(65.28,9.69)
  Bottom Layer w0.254: C81.2 R103.1 65.29,9.68 R92.1
PB5: length 15.6
  Top Layer w0.254: U11.58 65.02,20.44 65.02,13.24 v2(68.58,9.69)
  Bottom Layer w0.254: R91.1 68.62,9.65 R104.1 C82.2
PB6: length 18.3
  Top Layer w0.254: U11.59 65.51,13.64 69.6,9.56 v2(70.49,9.56)
  Bottom Layer w0.254: C83.2 R105.1 R90.1 71.82,9.56 v2(70.49,9.56)
PB7: length 66.3
  Top Layer w0.254: LED4.2 17.63,26.46 v2(18.89,26.46) ; v2(66.1,16.8) 66.01,16.88 U11.60 ; 24.63,26.47 26.8,26.47 27.42,27.1 28.18,27.1
  Inner1 w0.254: v2(18.89,26.46) 24.66,26.46 v2(24.68,26.47)
  Inner2 w0.254: v2(66.1,16.8) 65.59,16.29 28.93,16.29 18.89,26.33 v2(18.89,26.46)
PB8: length 30
  Top Layer w0.254: v2(66.6,17.56) 66.51,17.65 U11.61 ; 46.36,10.45 46.36,12.84 46.33,12.86
  Bottom Layer w0.254: v2(66.6,17.56) 64.44,19.72 54.86,19.72 46.36,11.21
PB9: length 33.7
  Top Layer w0.254: v2(93.75,22.91) 94.07,23.23 U1.42 ; U11.62 67.01,17.97 67.3,17.69 v2(67.56,17.69)
  Inner2 w0.254: v2(93.75,22.91) 88.53,17.69 v2(67.56,17.69)
PB12: length 36.5
  Top Layer w0.254: U11.34 56.31,29.45 v2(55.88,29.88) ; v2(26.96,27.47) 27.09,27.6 U2.32
  Inner2 w0.254: v2(26.96,27.47) 30.09,24.34 35.88,24.34 35.96,24.42 49.53,24.42 54.99,29.88 v2(55.88,29.88)
PB13: length 39.8
  Top Layer w0.254: U11.35 60.96,28.95 v2(61.72,28.19) ; v2(90.01,23.31) 90.61,23.91 91.57,23.91 92.07,24.42 U1.38
  Inner2 w0.254: v2(90.01,23.31) 86.47,19.77 70.14,19.77 v2(61.72,28.19)
PB14: length 41.4
  Top Layer w0.254: U1.40 93.07,24.07 92.26,23.26 92.26,22.75 v2(91.95,22.44) ; U11.36 60.36,28.45 v2(61.21,27.59)
  Inner2 w0.254: v2(91.95,22.44) 91.68,22.44 91.43,22.18 90.03,22.18 87.23,19.39 69.42,19.39 v2(61.21,27.59)
PB15: length 60.1
  Top Layer w0.254: 17.7,29.6 18.24,29.6 v2(19.36,28.48) ; U11.37 56.67,27.95 v2(56.01,28.61) ; 24.63,28 24.63,28.31 26.18,29.85 27.21,29.85 27.46,29.6 28.18,29.6
  Inner1 w0.254: v2(19.36,28.48) 24.14,28.48 v2(24.64,27.98)
  Bottom Layer w0.254: v2(19.36,28.48) 19.36,27.54 27.94,18.95 42.89,18.95 52.54,28.61 v2(56.01,28.61)
PC0: length 23.5
  Top Layer w0.254: U11.8 71.89,25.95 72.39,26.45 v2(73.28,26.45) ; U1.37 91.57,24.55 91.44,24.42 90.23,24.42 89.74,23.92 v2(89.28,23.92)
  Inner1 w0.254: v2(89.28,23.92) 85.08,23.92 83.06,25.94 73.79,25.94 v2(73.28,26.45)
PC1: length 25.5
  Top Layer w0.254: v2(91.06,23.15) 91.31,23.15 92.57,24.41 U1.39 ; v2(73.96,26.88) 73.76,27.09 72.52,27.09 71.88,26.45 U11.9
  Inner1 w0.254: v2(91.06,23.15) 89.66,24.55 85.09,24.55 83.27,26.36 74.69,26.36 74.17,26.88 v2(73.96,26.88)
PC2: length 27.2
  Top Layer w0.254: v2(92.86,22.99) 93.57,23.7 U1.41 ; v2(74.93,26.95) 74.41,27.47 72.4,27.47 71.88,26.95 U11.10
  Inner1 w0.254: v2(92.86,22.99) 90.64,25.21 85.06,25.21 83.32,26.95 v2(74.93,26.95)
PC3: length 42
  Top Layer w0.254: LED1.2 79.88,17.67 v2(79.88,18.68) ; U1.28 90.09,29.6 89.84,29.85 89.22,29.85 v2(87.37,28) ; U11.11 v2(67.18,27.45)
  Inner1 w0.254: v2(67.18,27.45) 66.55,26.81 66.55,23.79 71.66,18.68 v2(79.88,18.68)
  Bottom Layer w0.254: v2(87.37,28) 87.37,28.01 v2(84.2,28.01) 83.06,26.86 83.06,21.85 v2(79.88,18.68)
PC4: length 67.5
  Top Layer w0.254: U11.22 65.51,35.74 63.63,37.63 57.78,37.63 55.88,35.72 v2(55.88,33.36) ; U2.25 v2(23,31.1)
  Bottom Layer w0.254: v2(55.88,33.36) 55.42,33.36 43.18,21.12 28.07,21.12 23,26.18 v2(23,31.1)
PC6: length 35.5
  Top Layer w0.254: U11.38 54.63,27.45 v2(54.36,27.72) ; U2.37 v2(27.39,24.94)
  Inner1 w0.254: v2(54.36,27.72) 52.32,29.75 39.64,29.75 34.83,24.94 v2(27.39,24.94)
PC7: length 33.3
  Top Layer w0.254: U11.39 58.44,27.02 55.02,27.02 v2(54.86,26.86) ; v2(28.66,23.66) 29.16,23.66 29.79,24.28 U2.39
  Inner2 w0.254: v2(54.86,26.86) 51.66,23.66 v2(28.66,23.66)
PC8: length 32.8
  Top Layer w0.254: v2(30.06,23.02) 30.79,23.75 U2.41 ; v2(56.52,25.82) 57.15,26.45 U11.40
  Inner2 w0.254: v2(56.52,25.82) 53.08,22.38 30.31,22.38 30.06,22.64 v2(30.06,23.02)
PC10: length 17.8
  Top Layer w0.254: U11.52 62.01,19.25 v2(61.34,18.58)
  Bottom Layer w0.254: v2(61.34,18.58) 52.97,10.2 52.97,9.69 52.97,9.68 R109.1 C84.2
PC11: length 16.7
  Top Layer w0.254: v2(61.59,17.82) 62.51,18.73 U11.53
  Bottom Layer w0.254: C85.2 R110.1 56.3,9.65 R107.1 57.4,10.83 57.4,13.62 v2(61.59,17.82)
PC12: length 16.3
  Top Layer w0.254: U11.54 63.01,18.22 v2(62.36,17.56)
  Bottom Layer w0.254: v2(62.36,17.56) 58.67,13.88 58.67,10.64 R106.1 R111.1 C86.2
PC13: length 35.3
  Top Layer w0.254: LED2.2 v2(83.37,18.81) ; U11.2 68.28,22.95 v2(67.43,23.8) ; U1.33 90.16,27.1 89.53,26.47 v2(87.37,26.47)
  Inner1 w0.254: v2(67.43,23.8) 71.97,19.26 82.91,19.26 v2(83.37,18.81)
  Bottom Layer w0.254: v2(87.37,26.47) 87.37,22.81 v2(83.37,18.81)
PH: length 21.8
  Top Layer w0.6: 141.73,8.83 141.73,12.16 141.72,12.17 143.24,13.69 148.91,13.69 150.27,12.32 U6.8
  Top Layer w0.8: 144.87,13.69 L3.2
SCK: length 89.3
  Top Layer w0.254: U1.31 89.45,28.1 v2(88.7,27.34) ; v2(54.99,33.82) 54.99,35.59 57.66,38.26 65.46,38.26 66.7,37.02 67.65,37.02 68.22,36.45 68.22,35.63 v2(67.43,34.83) 67.01,34.42 U11.19 ; 28.18,28.1 26.71,28.1 v2(25.96,27.34)
  Inner2 w0.254: v2(67.43,34.83) 67.63,35.04 79.51,35.04 87.13,27.42 88.62,27.42 v2(88.7,27.34)
  Bottom Layer w0.254: v2(54.99,33.82) 42.93,21.75 29.08,21.75 25.96,24.87 v2(25.96,27.34)
UART_RX: length 28.2
  Top Layer w0.254: U13.5 77.99,8.28 77.47,8.8 v2(77.47,9.05) ; v2(68.01,29.75) U11.17
  Bottom Layer w0.254: v2(77.47,9.05) 68.01,18.51 v2(68.01,29.75)
UART_TX: length 31
  Top Layer w0.254: v2(82.17,8.8) 82.17,8.54 81.9,8.28 U13.4 ; v2(76.2,28.97) 76.18,28.95 74.91,28.95 74.28,29.58 73.32,29.58 72.69,28.95 U11.14
  Bottom Layer w0.254: v2(76.2,28.97) 80.01,25.16 80.01,19.63 79.3,18.92 79.3,11.67 v2(82.17,8.8)
VM: length 137.4
  Top Layer w0.254: U1.47 96.57,21.89 96.84,21.63 ; U2.47 33.78,24.93 33.78,23.53
  Top Layer w1.41: C24.1 97.14,18.34 v2(99.19,16.29) v2(100.67,16.29) v2(102.37,16.29) 106.81,16.29 v2(115.86,25.35) 115.87,25.35 v2(117.42,25.35) v2(118.97,25.35) v2(120.52,25.35) ; 44.02,28.03 v2(41.77,28.03) 39.69,28.03 ; C20.2 C21.1 v2(106.81,28.03)
  Inner1 w2: v2(102.37,16.29) v2(100.67,16.29) v2(99.19,16.29) 97.92,16.29 96.97,15.34 45.06,15.34 40.87,19.54 ; v2(34.36,19.54) 40.87,19.54 ; 40.87,19.54 46.55,19.54 51.18,24.17 51.18,26.43 49.58,28.03 v2(41.77,28.03)
  vias: v2(10.34,73.52) v2(10.34,72.82) v2(10.34,72.12) v2(10.34,71.42) v2(10.34,70.72) v2(10.34,70.02) v2(10.34,69.32) v2(10.34,68.62) v2(11.04,73.52) v2(11.04,72.82) v2(11.04,72.12) v2(11.04,71.42) v2(11.04,70.72) v2(11.04,70.02) v2(11.04,69.32) v2(11.04,68.62) v2(11.74,73.52) v2(11.74,72.82) v2(11.74,72.12) v2(11.74,71.42) v2(11.74,70.72) v2(11.74,70.02) v2(11.74,69.32) v2(11.74,68.62) v2(12.44,73.52) v2(12.44,72.82) v2(12.44,72.12) v2(12.44,71.42) v2(12.44,70.72) v2(12.44,70.02) v2(12.44,69.32) v2(12.44,68.62) v2(13.14,73.52) v2(13.14,72.82) v2(13.14,72.12) v2(13.14,71.42) v2(13.14,70.72) v2(13.14,70.02) v2(13.14,69.32) v2(13.14,68.62) v2(13.84,73.52) v2(13.84,72.82) v2(13.84,72.12) v2(13.84,71.42) v2(13.84,70.72) v2(13.84,70.02) v2(13.84,69.32) v2(13.84,68.62) v2(14.54,73.52) v2(14.54,72.82) v2(14.54,72.12) v2(14.54,71.42) v2(14.54,70.72) v2(14.54,70.02) v2(14.54,69.32) v2(14.54,68.62) v2(30.88,73.64) v2(30.88,72.94) v2(30.88,72.24) v2(30.88,71.54) v2(30.88,70.84) v2(30.88,70.14) v2(30.88,69.44) v2(30.88,68.74) v2(31.58,73.64) v2(31.58,72.94) v2(31.58,72.24) v2(31.58,71.54) v2(31.58,70.84) v2(31.58,70.14) v2(31.58,69.44) v2(31.58,68.74) v2(32.28,73.64) v2(32.28,72.94) v2(32.28,72.24) v2(32.28,71.54) v2(32.28,70.84) v2(32.28,70.14) v2(32.28,69.44) v2(32.28,68.74) v2(32.98,73.64) v2(32.98,72.94) v2(32.98,72.24) v2(32.98,71.54) v2(32.98,70.84) v2(32.98,70.14) v2(32.98,69.44) v2(32.98,68.74) v2(33.68,73.64) v2(33.68,72.94) v2(33.68,72.24) v2(33.68,71.54) v2(33.68,70.84) v2(33.68,70.14) v2(33.68,69.44) v2(33.68,68.74) v2(34.38,73.64) v2(34.38,72.94) v2(34.38,72.24) v2(34.38,71.54) v2(34.38,70.84) v2(34.38,70.14) v2(34.38,69.44) v2(34.38,68.74) v2(35.08,73.64) v2(35.08,72.94) v2(35.08,72.24) v2(35.08,71.54) v2(35.08,70.84) v2(35.08,70.14) v2(35.08,69.44) v2(35.08,68.74) v2(44.02,27.95) v2(51.36,73.77) v2(51.36,73.07) v2(51.36,72.37) v2(51.36,71.67) v2(51.36,70.97) v2(51.36,70.27) v2(51.36,69.57) v2(51.36,68.87) v2(52.06,73.77) v2(52.06,73.07) v2(52.06,72.37) v2(52.06,71.67) v2(52.06,70.97) v2(52.06,70.27) v2(52.06,69.57) v2(52.06,68.87) v2(52.76,73.77) v2(52.76,73.07) v2(52.76,72.37) v2(52.76,71.67) v2(52.76,70.97) v2(52.76,70.27) v2(52.76,69.57) v2(52.76,68.87) v2(53.46,73.77) v2(53.46,73.07) v2(53.46,72.37) v2(53.46,71.67) v2(53.46,70.97) v2(53.46,70.27) v2(53.46,69.57) v2(53.46,68.87) v2(54.16,73.77) v2(54.16,73.07) v2(54.16,72.37) v2(54.16,71.67) v2(54.16,70.97) v2(54.16,70.27) v2(54.16,69.57) v2(54.16,68.87) v2(54.86,73.77) v2(54.86,73.07) v2(54.86,72.37) v2(54.86,71.67) v2(54.86,70.97) v2(54.86,70.27) v2(54.86,69.57) v2(54.86,68.87) v2(55.56,73.77) v2(55.56,73.07) v2(55.56,72.37) v2(55.56,71.67) v2(55.56,70.97) v2(55.56,70.27) v2(55.56,69.57) v2(55.56,68.87) v2(73.58,73.52) v2(73.58,72.82) v2(73.58,72.12) v2(73.58,71.42) v2(73.58,70.72) v2(73.58,70.02) v2(73.58,69.32) v2(73.58,68.62) v2(74.28,73.52) v2(74.28,72.82) v2(74.28,72.12) v2(74.28,71.42) v2(74.28,70.72) v2(74.28,70.02) v2(74.28,69.32) v2(74.28,68.62) v2(74.98,73.52) v2(74.98,72.82) v2(74.98,72.12) v2(74.98,71.42) v2(74.98,70.72) v2(74.98,70.02) v2(74.98,69.32) v2(74.98,68.62) v2(75.68,73.52) v2(75.68,72.82) v2(75.68,72.12) v2(75.68,71.42) v2(75.68,70.72) v2(75.68,70.02) v2(75.68,69.32) v2(75.68,68.62) v2(76.38,73.52) v2(76.38,72.82) v2(76.38,72.12) v2(76.38,71.42) v2(76.38,70.72) v2(76.38,70.02) v2(76.38,69.32) v2(76.38,68.62) v2(77.08,73.52) v2(77.08,72.82) v2(77.08,72.12) v2(77.08,71.42) v2(77.08,70.72) v2(77.08,70.02) v2(77.08,69.32) v2(77.08,68.62) v2(77.78,73.52) v2(77.78,72.82) v2(77.78,72.12) v2(77.78,71.42) v2(77.78,70.72) v2(77.78,70.02) v2(77.78,69.32) v2(77.78,68.62) v2(87.48,15.14) v2(94.12,73.64) v2(94.12,72.94) v2(94.12,72.24) v2(94.12,71.54) v2(94.12,70.84) v2(94.12,70.14) v2(94.12,69.44) v2(94.12,68.74) v2(94.82,73.64) v2(94.82,72.94) v2(94.82,72.24) v2(94.82,71.54) v2(94.82,70.84) v2(94.82,70.14) v2(94.82,69.44) v2(94.82,68.74) v2(95.52,73.64) v2(95.52,72.94) v2(95.52,72.24) v2(95.52,71.54) v2(95.52,70.84) v2(95.52,70.14) v2(95.52,69.44) v2(95.52,68.74) v2(96.22,73.64) v2(96.22,72.94) v2(96.22,72.24) v2(96.22,71.54) v2(96.22,70.84) v2(96.22,70.14) v2(96.22,69.44) v2(96.22,68.74) v2(96.92,73.64) v2(96.92,72.94) v2(96.92,72.24) v2(96.92,71.54) v2(96.92,70.84) v2(96.92,70.14) v2(96.92,69.44) v2(96.92,68.74) v2(97.62,73.64) v2(97.62,72.94) v2(97.62,72.24) v2(97.62,71.54) v2(97.62,70.84) v2(97.62,70.14) v2(97.62,69.44) v2(97.62,68.74) v2(98.32,73.64) v2(98.32,72.94) v2(98.32,72.24) v2(98.32,71.54) v2(98.32,70.84) v2(98.32,70.14) v2(98.32,69.44) v2(98.32,68.74) v2(102.47,28.11) v2(104.55,27.95) v2(114.6,73.77) v2(114.6,73.07) v2(114.6,72.37) v2(114.6,71.67) v2(114.6,70.97) v2(114.6,70.27) v2(114.6,69.57) v2(114.6,68.87) v2(115.31,73.77) v2(115.31,73.07) v2(115.31,72.37) v2(115.31,71.67) v2(115.31,70.97) v2(115.31,70.27) v2(115.31,69.57) v2(115.31,68.87) v2(116,73.77) v2(116,73.07) v2(116,72.37) v2(116,71.67) v2(116,70.97) v2(116,70.27) v2(116,69.57) v2(116,68.87) v2(116.71,73.77) v2(116.71,73.07) v2(116.71,72.37) v2(116.71,71.67) v2(116.71,70.97) v2(116.71,70.27) v2(116.71,69.57) v2(116.71,68.87) v2(117.41,73.77) v2(117.41,73.07) v2(117.41,72.37) v2(117.41,71.67) v2(117.41,70.97) v2(117.41,70.27) v2(117.41,69.57) v2(117.41,68.87) v2(118.1,73.77) v2(118.1,73.07) v2(118.1,72.37) v2(118.1,71.67) v2(118.1,70.97) v2(118.1,70.27) v2(118.1,69.57) v2(118.1,68.87) v2(118.81,73.77) v2(118.81,73.07) v2(118.81,72.37) v2(118.81,71.67) v2(118.81,70.97) v2(118.81,70.27) v2(118.81,69.57) v2(118.81,68.87) v2(150.37,27.85) v2(150.37,26.75) v2(150.37,25.65) v2(150.37,24.55) v2(152.27,27.85) v2(152.27,26.75) v2(152.27,25.65) v2(152.27,24.55) v2(154.17,27.85) v2(154.17,26.75) v2(154.17,25.65) v2(154.17,24.55) v2(156.07,27.85) v2(156.07,26.75) v2(156.07,25.65) v2(156.07,24.55) v2(157.97,27.85) v2(157.97,26.75) v2(157.97,25.65) v2(157.97,24.55) v2(159.87,27.85) v2(159.87,26.75) v2(159.87,25.65) v2(159.87,24.55)
$1N551: length 8.6
  Top Layer w0.254: U6.4 142.24,6.89 141.51,6.17 R75.1
  Top Layer w0.6: R78.2 R75.1
$1N561: length 1.6
  Top Layer w0.5: U6.1 C63.2
$1N2428: length 1.8
  Top Layer w0.254: U7.4 121.79,13.56
$1N2597: length 5.1
  Top Layer w0.55: U7.3 R73.1
$1N72792: length 10.5
  Top Layer w0.254: X1.1 76.98,22.6 75.54,22.6 74.71,21.78 C77.1 73.54,22.68 72.15,22.68 71.77,23.06 71.77,24.23 71.55,24.45 U11.5
$1N72945: length 2.8
  Top Layer w0.254: R93.2 72.7,24.94 72.69,24.95 U11.6
$1N72949: length 3.8
  Top Layer w0.254: X1.3 75.79,23.36 C78.1 R93.1
$1N77944: length 5.3
  Top Layer w0.254: R95.1 54.41,22.95 54.91,23.45 U11.46
$1N77945: length 5.4
  Top Layer w0.254: U11.45 54.95,23.95 54.37,24.54 R96.1
$1N87601: length 1.3
  Top Layer w0.254: LED5.1 R74.2
$1N97516: length 4.7
  Bottom Layer w0.254: R103.2 65.29,3.61 U12.4
$1N97530: length 4.2
  Bottom Layer w0.254: R104.2 68.62,2.36 U12.3
